# Altium schematic sheet 02-MCU.SchDoc
size A3
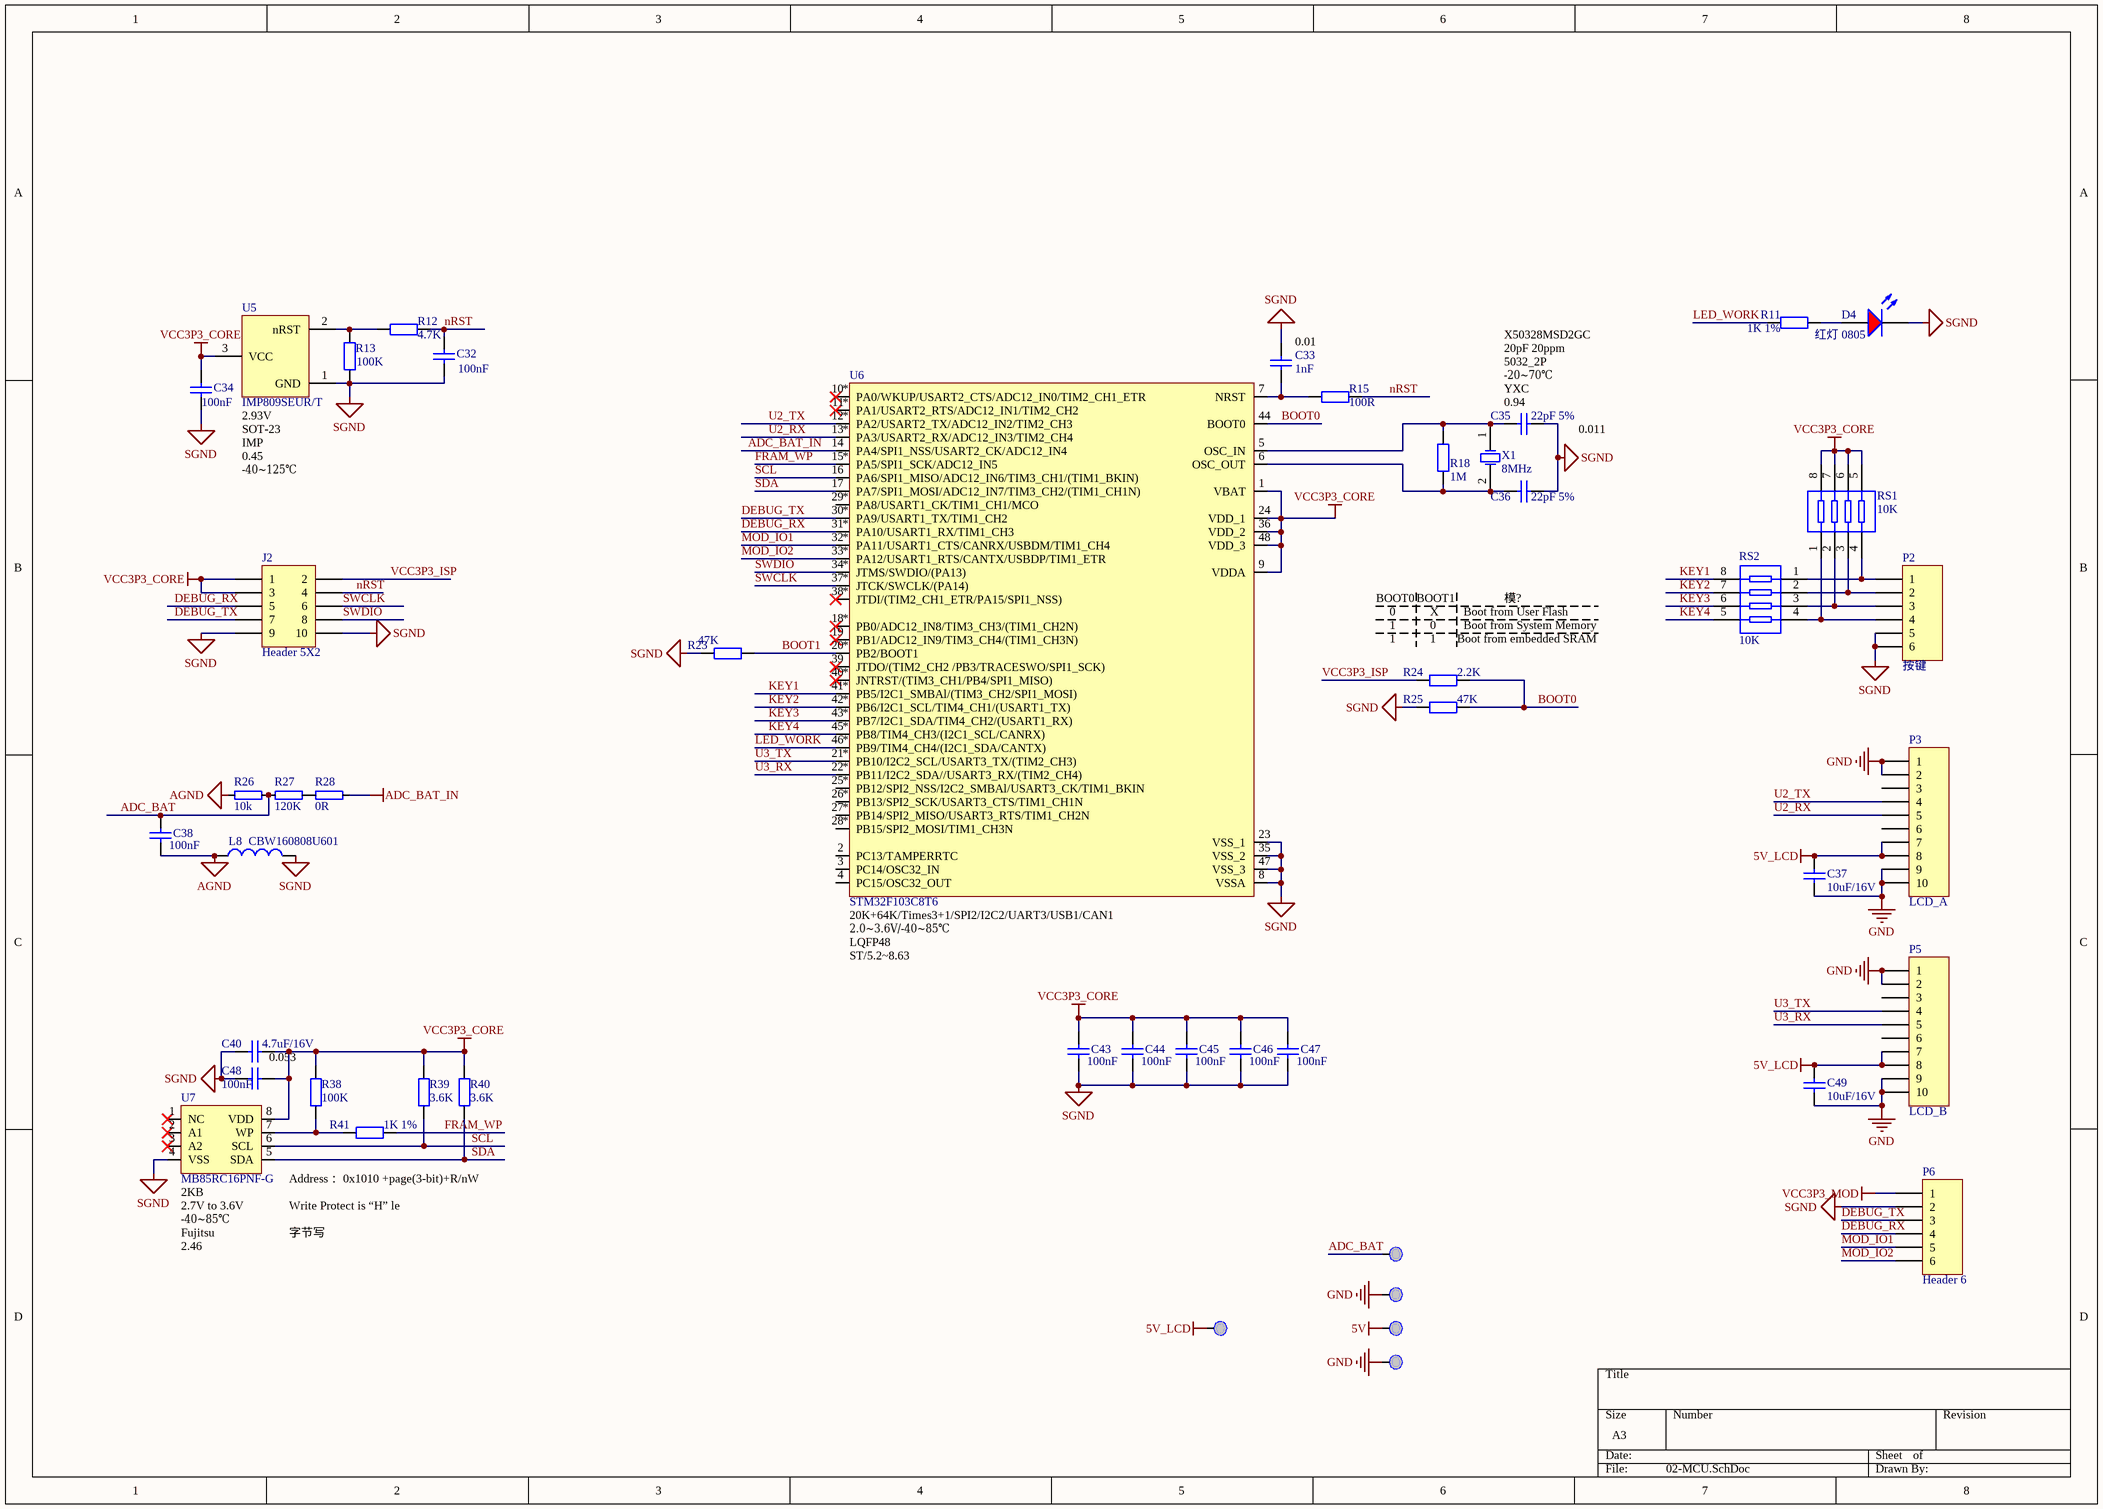
[diagram p0: 02-MCU.SchDoc]

## Parts
C32  100nF  [C1608(CC0603)]
C33  1nF  [C1608(CC0603)]
C34  100nF  [C1608(CC0603)]
C35  22pF 5%  [C1608(CC0603)]
C36  22pF 5%  [C1608(CC0603)]
C37  10uF/16V  [C2012(CC0805)]
C38  100nF  [C1608(CC0603)]
C40  4.7uF/16V  [C1608(CC0603)]
C43  100nF  [C1608(CC0603)]
C44  100nF  [C1608(CC0603)]
C45  100nF  [C1608(CC0603)]
C46  100nF  [C1608(CC0603)]
C47  100nF  [C1608(CC0603)]
C48  100nF  [C1608(CC0603)]
C49  10uF/16V  [C2012(CC0805)]
D4  红灯 0805  [LC-0603_LED_S1]
J2  Header 5X2  [HDR2X5]
L8  CBW160808U601  [C1608(CC0603)]
P2  按键  [PH-6A]
P3  LCD_A  [2mm-header_SMT]
P5  LCD_B  [2mm-header_SMT]
P6  Header 6  [HDR1X6]
R11  1K 1%  [C1608(CC0603)]
R12  4.7K  [C1608(CC0603)]
R13  100K  [C1608(CC0603)]
R15  100R  [C1608(CC0603)]
R18  1M  [C1608(CC0603)]
R23  47K  [C1608(CC0603)]
R24  2.2K  [C1608(CC0603)]
R25  47K  [C1608(CC0603)]
R26  10k  [C1608(CC0603)]
R27  120K  [C1608(CC0603)]
R28  0R  [C1608(CC0603)]
R38  100K  [C1608(CC0603)]
R39  3.6K  [C1608(CC0603)]
R40  3.6K  [C1608(CC0603)]
R41  1K 1%  [C1608(CC0603)]
RS1  10K  [LC-0603_Rx4]
RS2  10K  [LC-0603_Rx4]
T13  TP  [M2铜柱]  (value not drawn)
T15  TP  [M2铜柱]  (value not drawn)
T16  TP  [M2铜柱]  (value not drawn)
T18  TP  [M2铜柱]  (value not drawn)
T20  TP  [M2铜柱]  (value not drawn)
U5  IMP809SEUR/T  [SOT-23]
U6  STM32F103C8T6  [LC-LQFP-48_7x7x05P]
U7  MB85RC16PNF-G  [LC-SOP-8_150mil]
X1  8MHz  [XTAL-5032]

## Nets
5V: T15.1
5V_LCD: C37.2 C49.2 P3.7 P3.8 P5.7 P5.8 T16.1
ADC_BAT_IN: R28.1 U6.14(PA4/SPI1_NSS/USART2_CK/ADC12_IN4)
AGND: C38.2 L8.1 R26.2
GND: C37.1 C49.1 P3.1 P3.2 P3.9 P3.10 P5.1 P5.2 P5.9 P5.10 T18.1 T20.1
SGND: C32.2 C33.2 C34.2 C35.1 C36.1 C40.2 C43.2 C44.2 C45.2 C46.2 C47.2 C48.1 D4.K J2.9 J2.10 L8.2 P2.5 P2.6 P6.2 R13.1 R23.1 R25.1 U5.1(GND) U6.8(VSSA) U6.23(VSS_1) U6.35(VSS_2) U6.47(VSS_3) U7.4(VSS)
VCC3P3_CORE: C34.1 C40.1 C43.1 C44.1 C45.1 C46.1 C47.1 C48.2 J2.1 J2.3 R38.2 R39.2 R40.2 RS1.5 RS1.6 RS1.7 RS1.8 U5.3(VCC) U6.1(VBAT) U6.9(VDDA) U6.24(VDD_1) U6.36(VDD_2) U6.48(VDD_3) U7.8(VDD)
VCC3P3_MOD: P6.1
ADC_BAT: C38.1 R26.1 R27.2 T13.1
BOOT0: R24.1 R25.2 U6.44(BOOT0)
BOOT1: R23.2 U6.20(PB2/BOOT1)
DEBUG_RX: J2.5 P6.4 U6.31(PA10/USART1_RX/TIM1_CH3)
DEBUG_TX: J2.7 P6.3 U6.30(PA9/USART1_TX/TIM1_CH2)
FRAM_WP: R41.2 U6.15(PA5/SPI1_SCK/ADC12_IN5)
KEY1: RS2.8 U6.41(PB5/I2C1_SMBAl/(TIM3_CH2/SPI1_MOSI))
KEY2: RS2.7 U6.42(PB6/I2C1_SCL/TIM4_CH1/(USART1_TX))
KEY3: RS2.6 U6.43(PB7/I2C1_SDA/TIM4_CH2/(USART1_RX))
KEY4: RS2.5 U6.45(PB8/TIM4_CH3/(I2C1_SCL/CANRX))
LED_WORK: R11.1 U6.46(PB9/TIM4_CH4/(I2C1_SDA/CANTX))
MOD_IO1: P6.5 U6.32(PA11/USART1_CTS/CANRX/USBDM/TIM1_CH4)
MOD_IO2: P6.6 U6.33(PA12/USART1_RTS/CANTX/USBDP/TIM1_ETR)
nRST: C32.1 J2.4 R12.2 R15.2
SCL: R39.1 U6.16(PA6/SPI1_MISO/ADC12_IN6/TIM3_CH1/(TIM1_BKIN)) U7.6(SCL)
SDA: R40.1 U6.17(PA7/SPI1_MOSI/ADC12_IN7/TIM3_CH2/(TIM1_CH1N)) U7.5(SDA)
SWCLK: J2.6 U6.37(JTCK/SWCLK/(PA14))
SWDIO: J2.8 U6.34(JTMS/SWDIO/(PA13))
U2_RX: P3.5 U6.13(PA3/USART2_RX/ADC12_IN3/TIM2_CH4)
U2_TX: P3.4 U6.12(PA2/USART2_TX/ADC12_IN2/TIM2_CH3)
U3_RX: P5.5 U6.22(PB11/I2C2_SDA//USART3_RX/(TIM2_CH4))
U3_TX: P5.4 U6.21(PB10/I2C2_SCL/USART3_TX/(TIM2_CH3))
VCC3P3_ISP: J2.2 R24.2
NetC33_1: C33.1 R15.1 U6.7(NRST)
NetC35_2: C35.2 R18.1 U6.5(OSC_IN) X1.1(OSC1)
NetC36_2: C36.2 R18.2 U6.6(OSC_OUT) X1.2(OSC2)
NetD4_A: D4.A R11.2
NetP2_1: P2.1 RS1.4 RS2.1
NetP2_2: P2.2 RS1.3 RS2.2
NetP2_3: P2.3 RS1.2 RS2.3
NetP2_4: P2.4 RS1.1 RS2.4
NetR12_1: R12.1 R13.2 U5.2(nRST)
NetR27_1: R27.1 R28.2
NetR38_1: R38.1 R41.1 U7.7(WP)

Not connected (* = marked no-connect by the designer): P3 3 6; P5 3 6; U6 2(PC13/TAMPERRTC) 3(PC14/OSC32_IN) 4(PC15/OSC32_OUT) 10(PA0/WKUP/USART2_CTS/ADC12_IN0/TIM2_CH1_ETR)* 11(PA1/USART2_RTS/ADC12_IN1/TIM2_CH2)* 18(PB0/ADC12_IN8/TIM3_CH3/(TIM1_CH2N))* 19(PB1/ADC12_IN9/TIM3_CH4/(TIM1_CH3N))* 25(PB12/SPI2_NSS/I2C2_SMBAl/USART3_CK/TIM1_BKIN) 26(PB13/SPI2_SCK/USART3_CTS/TIM1_CH1N) 27(PB14/SPI2_MISO/USART3_RTS/TIM1_CH2N) 28(PB15/SPI2_MOSI/TIM1_CH3N) 29(PA8/USART1_CK/TIM1_CH1/MCO) 38(JTDI/(TIM2_CH1_ETR/PA15/SPI1_NSS))* 39(JTDO/(TIM2_CH2_/PB3/TRACESWO/SPI1_SCK))* 40(JNTRST/(TIM3_CH1/PB4/SPI1_MISO))*; U7 1(NC)* 2(A1)* 3(A2)*

## Notes on the sheet
- (near C33) 0.01
- 5032_2P
- 20pF 20ppm
- X50328MSD2GC
- (near C35) -20~70℃
- 2.93V
- SOT-23
- IMP
- (near U6) *
- (near C35) YXC
- (near C35) 0.94
- 0.011
- -40~125℃
- 0.45
- BOOT0
- 0
- 1
- BOOT1
- X
- (near R24) 1
- (near R24) Boot from embedded SRAM
- Boot from User Flash
- Boot from System Memory
- 模?
- (near U6) 20K+64K/Times3+1/SPI2/I2C2/UART3/USB1/CAN1
- (near U6) 2.0~3.6V/-40~85℃
- LQFP48
- ST/5.2~8.63
- (near C40) 0.053
- Address： 0x1010 +page(3-bit)+R/nW
- (near U7) 2KB
- (near U7) 2.7V to 3.6V
- -40~85℃
- Fujitsu
- 2.46
- Write Protect is “H” le
- 字节写

## Library data of the parts
C32-C36 C38 C43-C48 = Cap: Capacitor; Published: 8-Jun-2000; LatestRevisionDate: 17-Jul-2002; LatestRevisionNote: Re-released for DXP Platform.; PackageReference: RAD-0.3; Publisher: Altium Limited
  C32 C34 C38 C43-C48: Value: 100nF
  C33: Value: 1nF
  C35 C36: Value: 22pF 5%
C37 C49 = Cap: Capacitor; Value: 100pF; Published: 8-Jun-2000; LatestRevisionDate: 17-Jul-2002; LatestRevisionNote: Re-released for DXP Platform.; PackageReference: RAD-0.3; Publisher: Altium Limited; PackageDescription: Radial Cap, Thru-Hole; 2 Leads; 0.3 in Pin Spacing
C40 = Cap: Capacitor; Value: 2.2uF/25V; Published: 8-Jun-2000; LatestRevisionDate: 17-Jul-2002; LatestRevisionNote: Re-released for DXP Platform.; PackageReference: RAD-0.3; Publisher: Altium Limited
D4 = 0805 红灯: 发光二极管; ComponentLink1Description: 供应商链接; ComponentLink1URL: http://www.szlcsc.com/product/details_2668.html; Package: 0805; Supplier: LC; SuppliersPartNumber: C2295
J2 = Header 5X2: Header, 5-Pin, Dual row; LatestRevisionDate: 17-Jul-2002; LatestRevisionNote: Re-released for DXP Platform.; Publisher: Altium Limited
L8 = Inductor: Code_IEC: 1005; Published: 8-Jun-2000; LatestRevisionDate: 29-May-2009; LatestRevisionNote: IPC-7351 Footprint Added.; PackageReference: 0402-A; Publisher: Altium Limited; PackageDescription: Chip Inductor; Code_JEITA: 0402; Value: CBW160808U601
P2 P6 = Header 6: Header, 6-Pin; LatestRevisionDate: 17-Jul-2002; LatestRevisionNote: Re-released for DXP Platform.; Publisher: Altium Limited
P3 P5 = Header 10: Header, 10-Pin; LatestRevisionDate: 17-Jul-2002; LatestRevisionNote: Re-released for DXP Platform.; Publisher: Altium Limited
R11-R13 R15 R18 R23-R25 R38-R41 = Res2: Resistor; Published: 8-Jun-2000; LatestRevisionDate: 17-Jul-2002; LatestRevisionNote: Re-released for DXP Platform.; PackageReference: AXIAL-0.4; Publisher: Altium Limited
  R11: Value: 1K 1%
  R12: Value: 4.7K
  R13 R38: Value: 100K
  R15: Value: 100R
  R18: Value: 1M
  R23 R25: Value: 47K
  R24: Value: 2.2K
  R39 R40: Value: 3.6K
  R41: Value: 1K
R26-R28 = RES5
RS1 RS2 = 0603*4  10KΩ (103) 5%: 贴片排阻; ComponentLink1Description: 供应商链接; ComponentLink1URL: http://www.szlcsc.com/product/details_30472.html; Package: 0603*4; Supplier: LC; SuppliersPartNumber: C29718
U5 = CAT810
U6 = STM32F103Cx
U7 = FM24CL04
X1 = XTAL: Crystal Oscillator; Published: 8-Jun-2000; LatestRevisionDate: 17-Jul-2002; LatestRevisionNote: Re-released for DXP Platform.; PackageReference: R38; Publisher: Altium Limited